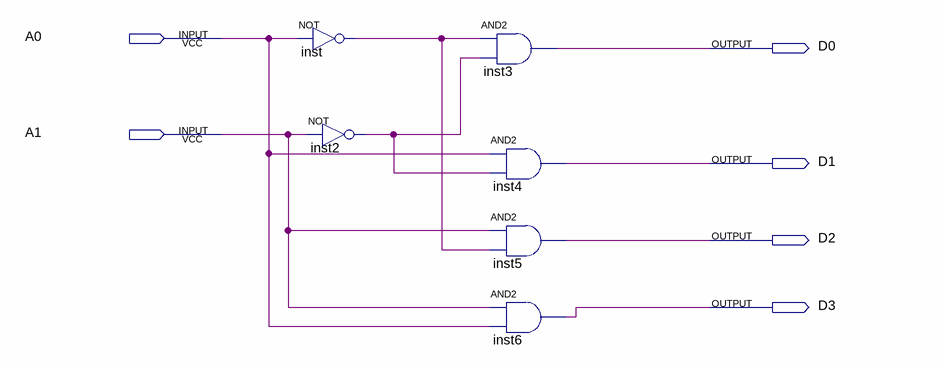
[diagram p0: schematic sheet]
// Quartus schematic ea01m01e01.bdf as structural Verilog: 6 symbols, 6 pins
module ea01m01e01 (
  input  A0,
  input  A1,
  output D0,
  output D1,
  output D2,
  output D3
);

  wire inst2_out, inst_out;

  not inst (inst_out, A0);
  not inst2 (inst2_out, A1);
  and inst3 (D0, inst_out, inst2_out);
  and inst4 (D1, A0, inst2_out);
  and inst5 (D2, A1, inst_out);
  and inst6 (D3, A1, A0);
endmodule
